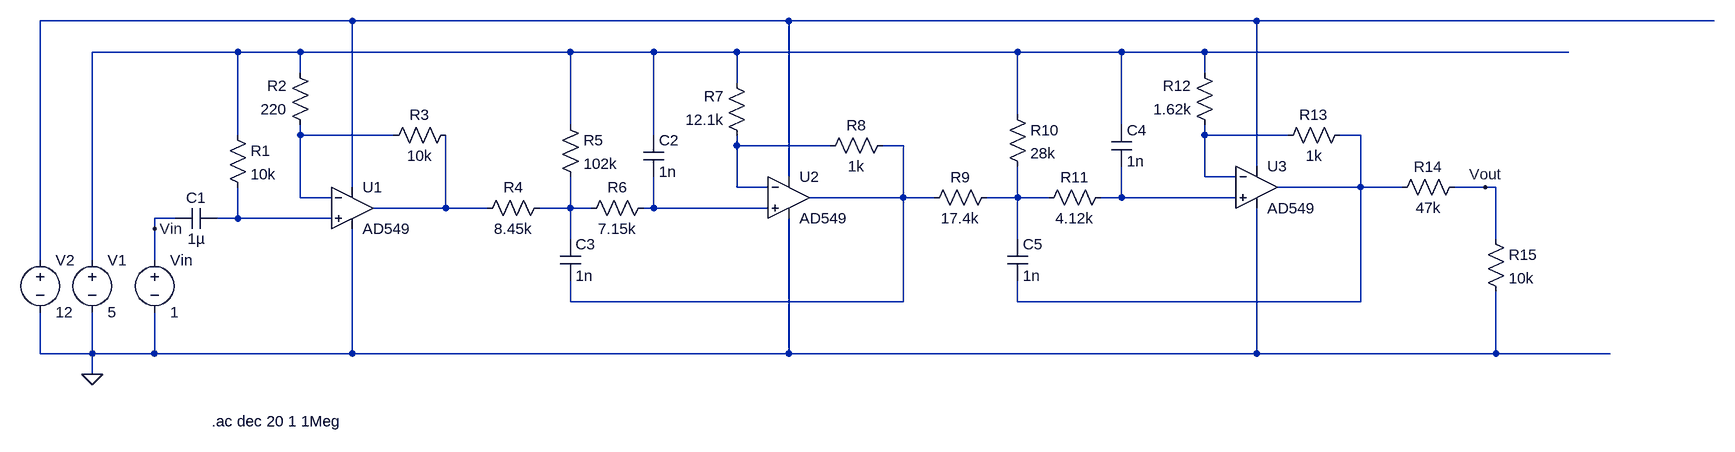
[diagram p0: schematic video_amp.asc]
video_amp.asc, the LTspice schematic file:
Version 4
SHEET 1 2180 680
WIRE 80 -48 -400 -48
WIRE 752 -48 80 -48
WIRE 1472 -48 752 -48
WIRE 2176 -48 1472 -48
WIRE -96 0 -320 0
WIRE 0 0 -96 0
WIRE 416 0 0 0
WIRE 544 0 416 0
WIRE 672 0 544 0
WIRE 1104 0 672 0
WIRE 1264 0 1104 0
WIRE 1392 0 1264 0
WIRE 1952 0 1392 0
WIRE 0 32 0 0
WIRE 1392 32 1392 0
WIRE 672 48 672 0
WIRE 1104 96 1104 0
WIRE 416 112 416 0
WIRE 1264 112 1264 0
WIRE -96 128 -96 0
WIRE 0 128 0 112
WIRE 144 128 0 128
WIRE 544 128 544 0
WIRE 1392 128 1392 112
WIRE 1520 128 1392 128
WIRE 1632 128 1600 128
WIRE 672 144 672 128
WIRE 816 144 672 144
WIRE 928 144 896 144
WIRE 1472 176 1472 -48
WIRE 752 192 752 -48
WIRE 1392 192 1392 128
WIRE 1440 192 1392 192
WIRE 80 208 80 -48
WIRE 672 208 672 144
WIRE 720 208 672 208
WIRE 1632 208 1632 128
WIRE 1632 208 1504 208
WIRE 1696 208 1632 208
WIRE 1824 208 1776 208
WIRE 1840 208 1824 208
WIRE 0 224 0 128
WIRE 48 224 0 224
WIRE 928 224 928 144
WIRE 928 224 784 224
WIRE 976 224 928 224
WIRE 1104 224 1104 176
WIRE 1104 224 1056 224
WIRE 1152 224 1104 224
WIRE 1264 224 1264 176
WIRE 1264 224 1232 224
WIRE 1440 224 1264 224
WIRE 224 240 224 128
WIRE 224 240 112 240
WIRE 288 240 224 240
WIRE 416 240 416 192
WIRE 416 240 368 240
WIRE 448 240 416 240
WIRE 544 240 544 192
WIRE 544 240 528 240
WIRE 720 240 544 240
WIRE -192 256 -224 256
WIRE -96 256 -96 208
WIRE -96 256 -128 256
WIRE 48 256 -96 256
WIRE -224 272 -224 256
WIRE 416 288 416 240
WIRE 1104 288 1104 224
WIRE 1840 288 1840 208
WIRE -400 320 -400 -48
WIRE -320 320 -320 0
WIRE -224 320 -224 272
WIRE 416 384 416 352
WIRE 928 384 928 224
WIRE 928 384 416 384
WIRE 1104 384 1104 352
WIRE 1632 384 1632 208
WIRE 1632 384 1104 384
WIRE -400 464 -400 400
WIRE -320 464 -320 400
WIRE -320 464 -400 464
WIRE -224 464 -224 400
WIRE -224 464 -320 464
WIRE 80 464 80 272
WIRE 80 464 -224 464
WIRE 752 464 752 256
WIRE 752 464 80 464
WIRE 1472 464 1472 240
WIRE 1472 464 752 464
WIRE 1840 464 1840 368
WIRE 1840 464 1472 464
WIRE 2016 464 1840 464
WIRE -320 496 -320 464
FLAG -320 496 0
FLAG -224 272 Vin
FLAG 1824 208 Vout
SYMBOL Opamps/AD549 80 176 R0
SYMATTR InstName U1
SYMBOL res -112 112 R0
SYMATTR InstName R1
SYMATTR Value 10k
SYMBOL res 16 128 R180
WINDOW 0 36 76 Left 2
WINDOW 3 36 40 Left 2
SYMATTR InstName R2
SYMATTR Value 220
SYMBOL res 128 144 R270
WINDOW 0 32 56 VTop 2
WINDOW 3 0 56 VBottom 2
SYMATTR InstName R3
SYMATTR Value 10k
SYMBOL res 272 256 R270
WINDOW 0 32 56 VTop 2
WINDOW 3 0 56 VBottom 2
SYMATTR InstName R4
SYMATTR Value 8.45k
SYMBOL res 400 96 R0
SYMATTR InstName R5
SYMATTR Value 102k
SYMBOL res 544 224 R90
WINDOW 0 0 56 VBottom 2
WINDOW 3 32 56 VTop 2
SYMATTR InstName R6
SYMATTR Value 7.15k
SYMBOL res 688 144 R180
WINDOW 0 36 76 Left 2
WINDOW 3 36 40 Left 2
SYMATTR InstName R7
SYMATTR Value 12.1k
SYMBOL res 800 160 R270
WINDOW 0 32 56 VTop 2
WINDOW 3 0 56 VBottom 2
SYMATTR InstName R8
SYMATTR Value 1k
SYMBOL res 960 240 R270
WINDOW 0 32 56 VTop 2
WINDOW 3 0 56 VBottom 2
SYMATTR InstName R9
SYMATTR Value 17.4k
SYMBOL res 1088 80 R0
SYMATTR InstName R10
SYMATTR Value 28k
SYMBOL res 1248 208 R90
WINDOW 0 0 56 VBottom 2
WINDOW 3 32 56 VTop 2
SYMATTR InstName R11
SYMATTR Value 4.12k
SYMBOL res 1408 128 R180
WINDOW 0 36 76 Left 2
WINDOW 3 36 40 Left 2
SYMATTR InstName R12
SYMATTR Value 1.62k
SYMBOL res 1504 144 R270
WINDOW 0 32 56 VTop 2
WINDOW 3 0 56 VBottom 2
SYMATTR InstName R13
SYMATTR Value 1k
SYMBOL res 1680 224 R270
WINDOW 0 32 56 VTop 2
WINDOW 3 0 56 VBottom 2
SYMATTR InstName R14
SYMATTR Value 47k
SYMBOL res 1824 272 R0
SYMATTR InstName R15
SYMATTR Value 10k
SYMBOL Opamps/AD549 752 160 R0
SYMATTR InstName U2
SYMBOL Opamps/AD549 1472 144 R0
SYMATTR InstName U3
SYMBOL voltage -320 304 R0
SYMATTR InstName V1
SYMATTR Value 5
SYMBOL voltage -400 304 R0
SYMATTR InstName V2
SYMATTR Value 12
SYMBOL voltage -224 304 R0
WINDOW 39 0 0 Left 0
SYMATTR InstName Vin
SYMATTR Value 1
SYMATTR Value2 AC 1 0
SYMBOL cap -128 240 R90
WINDOW 0 0 32 VBottom 2
WINDOW 3 32 32 VTop 2
SYMATTR InstName C1
SYMATTR Value 1µ
SYMBOL cap 528 128 R0
SYMATTR InstName C2
SYMATTR Value 1n
SYMBOL cap 400 288 R0
SYMATTR InstName C3
SYMATTR Value 1n
SYMBOL cap 1248 112 R0
SYMATTR InstName C4
SYMATTR Value 1n
SYMBOL cap 1088 288 R0
SYMATTR InstName C5
SYMATTR Value 1n
TEXT -136 568 Left 2 !.ac dec 20 1 1Meg

The netlist it stands for:
* video_amp.asc
XU1 N013 N003 N001 0 N010 AD549  ; pins In+ In- V+ V- OUT
R1 N002 N013 10k
R2 N003 N002 220
R3 N003 N010 10k
R4 N010 N011 8.45k
R5 N002 N011 102k
R6 N012 N011 7.15k
R7 N006 N002 12.1k
R8 N006 N007 1k
R9 N007 N008 17.4k
R10 N002 N008 28k
R11 N009 N008 4.12k
R12 N004 N002 1.62k
R13 N004 N005 1k
R14 N005 Vout 47k
R15 Vout 0 10k
XU2 N012 N006 N001 0 N007 AD549  ; pins In+ In- V+ V- OUT
XU3 N009 N004 N001 0 N005 AD549  ; pins In+ In- V+ V- OUT
V1 N002 0 5
V2 N001 0 12
Vin Vin 0 1 AC 1 0
C1 N013 Vin 1µ
C2 N002 N012 1n
C3 N011 N007 1n
C4 N002 N009 1n
C5 N008 N005 1n
.ac dec 20 1 1Meg
.backanno
.end